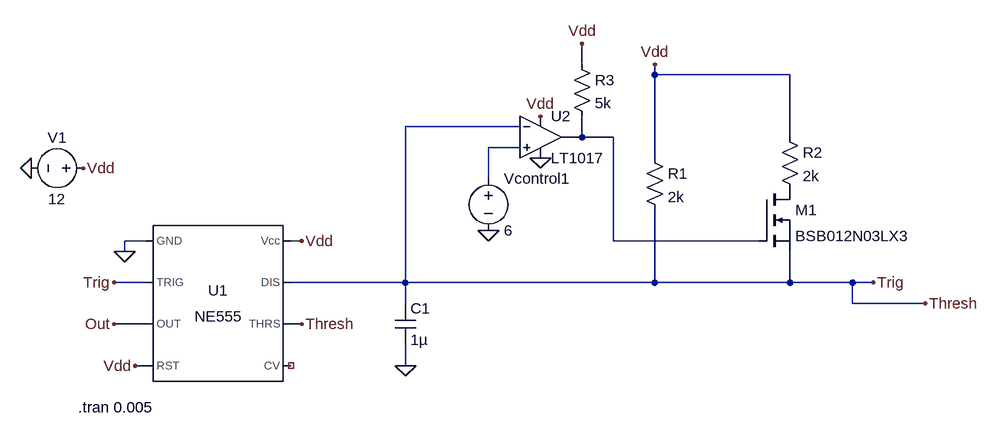
[diagram p0: schematic EE409_Q3_555Triangle_pt2.asc]
EE409_Q3_555Triangle_pt2.asc, the LTspice schematic file:
Version 4.1
SHEET 1 880 680
WIRE 16 -208 16 -240
WIRE 128 -192 128 -208
WIRE 336 -192 128 -192
WIRE -80 -112 -256 -112
WIRE 16 -96 16 -128
WIRE 16 -96 -16 -96
WIRE 64 -96 16 -96
WIRE 336 -96 336 -192
WIRE -80 -80 -128 -80
WIRE 128 -64 128 -192
WIRE -128 -32 -128 -80
WIRE -656 64 -688 64
WIRE -416 64 -432 64
WIRE 64 64 64 -96
WIRE 288 64 64 64
WIRE -688 80 -688 64
WIRE -656 128 -704 128
WIRE -256 128 -256 -112
WIRE -256 128 -432 128
WIRE 128 128 128 16
WIRE 128 128 -256 128
WIRE 336 128 336 80
WIRE 336 128 128 128
WIRE 432 128 336 128
WIRE 464 128 432 128
WIRE -256 160 -256 128
WIRE 432 160 432 128
WIRE 544 160 432 160
WIRE -656 192 -704 192
WIRE -416 192 -432 192
WIRE -656 256 -672 256
WIRE -256 256 -256 224
FLAG -416 64 Vdd
FLAG -672 256 Vdd
FLAG -688 80 0
FLAG -256 256 0
FLAG -416 192 Thresh
FLAG -704 128 Trig
FLAG -704 192 Out
FLAG 464 128 Trig
FLAG 544 160 Thresh
FLAG -128 48 0
FLAG -48 -64 0
FLAG -48 -128 Vdd
FLAG -832 -48 0
FLAG -752 -48 Vdd
FLAG 128 -208 Vdd
FLAG 16 -240 Vdd
SYMBOL Misc\\NE555 -544 160 R0
SYMATTR InstName U1
SYMBOL cap -272 160 R0
SYMATTR InstName C1
SYMATTR Value 1µ
SYMBOL Comparators\\LT1017 -48 -96 R0
SYMATTR InstName U2
SYMBOL voltage -128 -48 R0
WINDOW 123 0 0 Left 0
WINDOW 39 0 0 Left 0
SYMATTR InstName Vcontrol1
SYMATTR Value 6
SYMBOL voltage -736 -48 R90
WINDOW 0 -32 56 VBottom 2
WINDOW 3 32 56 VTop 2
WINDOW 123 0 0 Left 0
WINDOW 39 0 0 Left 0
SYMATTR InstName V1
SYMATTR Value 12
SYMBOL res 112 -80 R0
SYMATTR InstName R1
SYMATTR Value 2k
SYMBOL res 320 -112 R0
SYMATTR InstName R2
SYMATTR Value 2k
SYMBOL res 0 -224 R0
SYMATTR InstName R3
SYMATTR Value 5k
SYMBOL nmos 288 -16 R0
SYMATTR InstName M1
SYMATTR Value BSB012N03LX3
TEXT -760 320 Left 2 !.tran 0.005

The netlist it stands for:
* EE409_Q3_555Triangle_pt2.asc
X§U1 0 Trig Out Vdd NC_01 Trig Trig Vdd NE555  ; pins GND TRIG OUT RST CV THRS DIS Vcc
C1 Trig 0 1µ
X§U2 N002 Trig Vdd 0 N001 LT1017  ; pins In+ In- V+ V- OUT
Vcontrol1 N002 0 6
V1 Vdd 0 12
R1 Vdd Trig 2k
R2 Vdd P001 2k
R3 Vdd N001 5k
M1 P001 N001 Trig Trig BSB012N03LX3
.model NMOS NMOS
.model PMOS PMOS
.lib standard.mos
.tran 0.005
.lib NE555.sub
.backanno
.end